# EAGLE design unoshield-v4 (EAGLE 8.7.1)
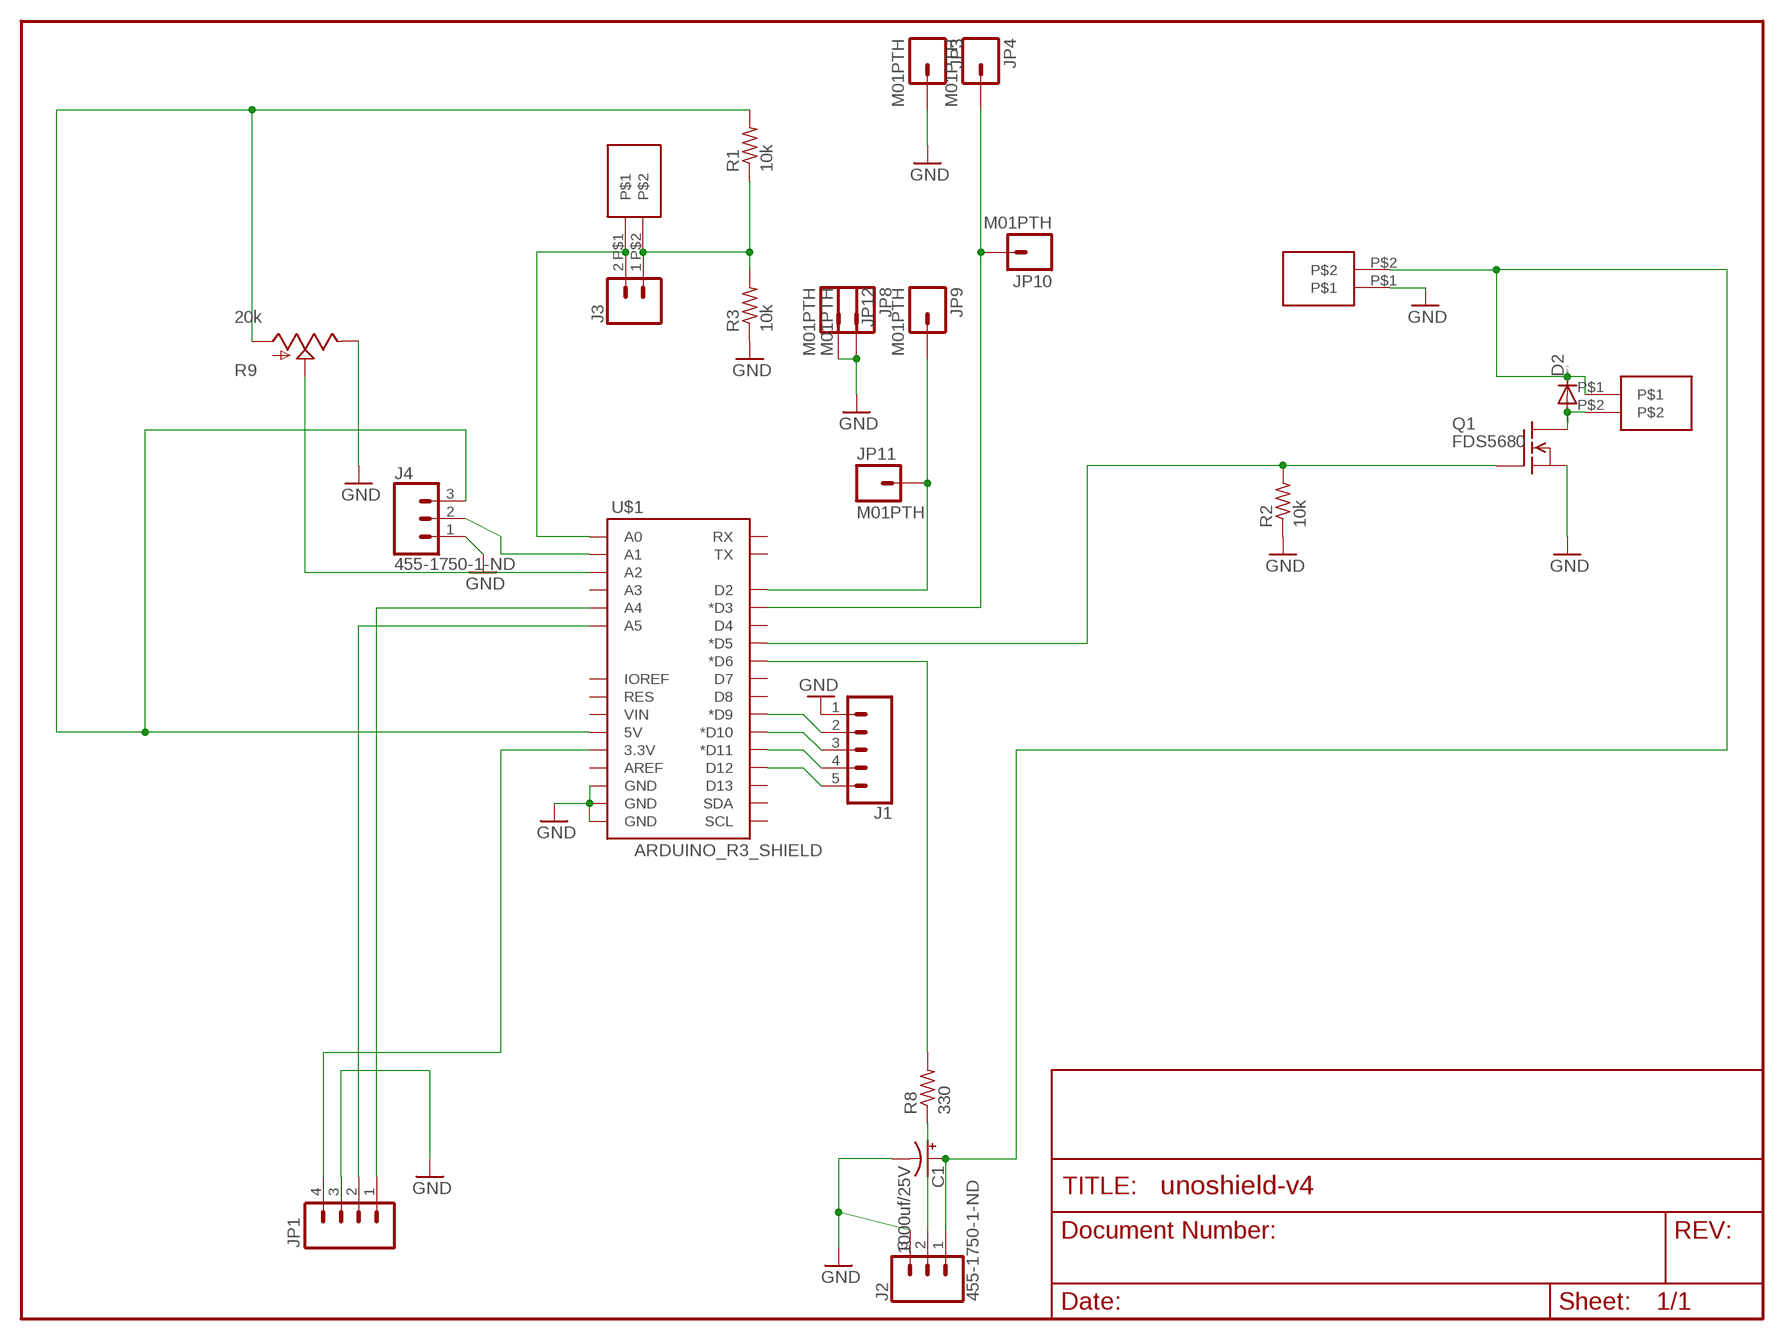
[diagram p0: schematic, sheet 1]

## Parts
C1  1000uf/25V  1000UF-25V(PTH)KIT  [CPOL-RADIAL-1000UF-25V-KIT]
D2  DIODE-DO-214AC  [DO-214AC]
J1  CONN_05  [1X05]
J2  455-1750-1-ND  CONN_03  [1X03]
J3  CONN_02  [1X02]
J4  455-1750-1-ND  CONN_03  [1X03]
JP1  M04PTH  [1X04]
JP3  M01PTH  [1X01]
JP4  M01PTH  [1X01]
JP8  M01PTH  [1X01]
JP9  M01PTH  [1X01]
JP10  M01PTH  [1X01]
JP11  M01PTH  [1X01]
JP12  M01PTH  [1X01]
Q1  FDS5680  [SO-8]
R1  10k  R-US_R0603  [R0603]
R2  10k  R-US_R0603  [R0603]
R3  10k  R-US_R0603  [R0603]
R8  330  R-US_R0603  [R0603]
R9  20k  POTALPS-KIT  [ALPS_POT_KIT]
U$1  ARDUINO_R3_SHIELD  [UNO_R3_SHIELD]
U$6  SPRING-TERMINAL  [SPRING-TERMINAL]
X1  SPRING-TERMINAL  [SPRING-TERMINAL]
X2  SPRING-TERMINAL  [SPRING-TERMINAL]

## Nets
5V: J4.3 R1.2 R9.P$3(A) U$1.5V
BUTTON: JP4.1 JP10.1 U$1.D3(*D3)
CL: JP1.2 U$1.A5
DA: JP1.1 U$1.A4
GND: C1.- J1.1 J2.3 J4.1 JP1.3 JP3.1 JP8.1 JP12.1 Q1.1(S) Q1.2(S) Q1.3(S) R2.1 R3.1 R9.P$1(E) U$1.GND@0(GND) U$1.GND@1(GND) U$1.GND@2(GND) X1.P$1
N$1: Q1.4(G) R2.2 U$1.D5(*D5)
N$4: R8.2 U$1.D6(*D6)
N$5: J3.1 R1.1 R3.2 X2.P$2
N$6: J4.2 U$1.A1
N$7: J1.5 U$1.D12
N$8: D2.A Q1.5(D) Q1.6(D) Q1.7(D) Q1.8(D) U$6.P$2
N$9: J1.4 U$1.D11(*D11)
N$10: J1.3 U$1.D10(*D10)
N$11: J1.2 U$1.D9(*D9)
N$12: JP9.1 JP11.1 U$1.D2
N$23: J3.2 U$1.A0 X2.P$1
N$25: J2.2 R8.1
N$28: R9.P$2(S) U$1.A2
VCC: JP1.4 U$1.3.3V
VIN: C1.+ D2.C J2.1 U$6.P$1 X1.P$2
Unconnected: U$1.A3 U$1.AREF U$1.D4 U$1.D7 U$1.D8 U$1.D13 U$1.IOREF U$1.RES U$1.RX U$1.SCL U$1.SDA U$1.TX U$1.VIN

## Library data of the parts
C1 = SparkFun-Capacitors:1000UF-25V(PTH): CAP-08070; PROD_ID: CAP-09538
D2 = diode:DIODE-: DIODE
J1 = SparkFun-Connectors:CONN_05: Multi connection point. Often used as Generic Header-pin footprint for 0.1 inch spaced/style header connections On any of the 0.1 inch spaced packages, you can populate with these: Break Away Headers - Straight <https://www.sparkfun.com/products/116> (PRT-00116) Break Away Male Headers - Right Angle <https://www.sparkfun.com/products/553> (PRT-00553) Female Headers <https://www.sparkfun.com/products/115> (PRT-00115) Break Away Headers - Machine Pin <https://www.sparkfun.com/products/117> (PRT-00117) Break Away Female Headers - Swiss Machine Pin <https://www.sparkfun.com/products/743> (PRT-00743) For SCREWTERMINALS and SPRING TERMINALS visit here: Screw Terimnals on SparkFun.com <https://www.sparkfun.com/search/results?term=Screw+Terminals> (5mm/3.5mm/2.54mm spacing) This device is also useful as a general connection point to wire up your design to another part of your project. Our various solder wires solder well into these plated through hole pads. Hook-Up Wire - Assortment (Stranded, 22 AWG) <https://www.sparkfun.com/products/11375> (PRT-11375) Hook-Up Wire - Assortment (Solid Core, 22 AWG) <https://www.sparkfun.com/products/11367> (PRT-11367) View the entire wire category on our website here <https://www.sparkfun.com/categories/141> Special notes: Molex polarized connector foot print use with SKU : PRT-08231 with associated crimp pins and housings. 1MM SMD Version SKU: PRT-10208
J2 J4 = SparkFun-Connectors:CONN_03: Multi connection point. Often used as Generic Header-pin footprint for 0.1 inch spaced/style header connections On any of the 0.1 inch spaced packages, you can populate with these: Break Away Headers - Straight <https://www.sparkfun.com/products/116> (PRT-00116) Break Away Male Headers - Right Angle <https://www.sparkfun.com/products/553> (PRT-00553) Female Headers <https://www.sparkfun.com/products/115> (PRT-00115) Break Away Headers - Machine Pin <https://www.sparkfun.com/products/117> (PRT-00117) Break Away Female Headers - Swiss Machine Pin <https://www.sparkfun.com/products/743> (PRT-00743) Stackable Header - 3 Pin (Female, 0.1") <https://www.sparkfun.com/products/13875> (PRT-13875) For SCREWTERMINALS and SPRING TERMINALS visit here: Screw Terimnals on SparkFun.com <https://www.sparkfun.com/search/results?term=Screw+Terminals> (5mm/3.5mm/2.54mm spacing) This device is also useful as a general connection point to wire up your design to another part of your project. Our various solder wires solder well into these plated through hole pads. Hook-Up Wire - Assortment (Stranded, 22 AWG) <https://www.sparkfun.com/products/11375> (PRT-11375) Hook-Up Wire - Assortment (Solid Core, 22 AWG) <https://www.sparkfun.com/products/11367> (PRT-11367) View the entire wire category on our website here <https://www.sparkfun.com/categories/141> Special notes: Molex polarized connector foot print use with SKU : PRT-08232 with associated crimp pins and housings.; PROD_ID: XXX-00000
J3 = SparkFun-Connectors:CONN_02: Multi connection point. Often used as Generic Header-pin footprint for 0.1 inch spaced/style header connections On any of the 0.1 inch spaced packages, you can populate with these: Break Away Headers - Straight <https://www.sparkfun.com/products/116> (PRT-00116) Break Away Male Headers - Right Angle <https://www.sparkfun.com/products/553> (PRT-00553) Female Headers <https://www.sparkfun.com/products/115> (PRT-00115) Break Away Headers - Machine Pin <https://www.sparkfun.com/products/117> (PRT-00117) Break Away Female Headers - Swiss Machine Pin <https://www.sparkfun.com/products/743> (PRT-00743) For SCREWTERMINALS and SPRING TERMINALS visit here: Screw Terimnals on SparkFun.com <https://www.sparkfun.com/search/results?term=Screw+Terminals> (5mm/3.5mm/2.54mm spacing) This device is also useful as a general connection point to wire up your design to another part of your project. Our various solder wires solder well into these plated through hole pads. Hook-Up Wire - Assortment (Stranded, 22 AWG) <https://www.sparkfun.com/products/11375> (PRT-11375) Hook-Up Wire - Assortment (Solid Core, 22 AWG) <https://www.sparkfun.com/products/11367> (PRT-11367) View the entire wire category on our website here <https://www.sparkfun.com/categories/141> Special notes: Molex polarized connector foot print use with: PRT-08233 with associated crimp pins and housings. 2.54_SCREWTERM for use with PRT-10571. 3.5mm Screw Terminal footprints for PRT-08084 5mm Screw Terminal footprints for use with PRT-08432
JP1 = SparkFun-Connectors:M04: Header 4 Standard 4-pin 0.1" header. Use with straight break away headers (SKU : PRT-00116), right angle break away headers (PRT-00553), swiss pins (PRT-00743), machine pins (PRT-00117), and female headers (PRT-00115). Molex polarized connector foot print use with SKU : PRT-08231 with associated crimp pins and housings. 1MM SMD Version SKU: PRT-10208
JP3 JP4 JP8-JP12 = SparkFun-Connectors:M01: Header 1 Standard 1-pin 0.1" header. Use with straight break away headers (SKU : PRT-00116), right angle break away headers (PRT-00553), swiss pins (PRT-00743), machine pins (PRT-00117), and female headers (PRT-00115).
Q1 = transistor-fet:FDS5680: 60V N-Channel PowerTrench TM MOSFET FAIRCHILD FDS5680.pdf
R1-R3 R8 = resistor:R-US_: RESISTOR, American symbol
R9 = SparkFun-Electromechanical:POT
U$1 = SparkFun-Boards:ARDUINO_R3_SHIELD: Shield form compatible with the Arduino Uno R3.
U$6 X1 X2 = spietz-library:SPRING-TERMINAL

## Net classes
0 default: width 0.203 mm
1 vcc: width 0.254 mm

## Board
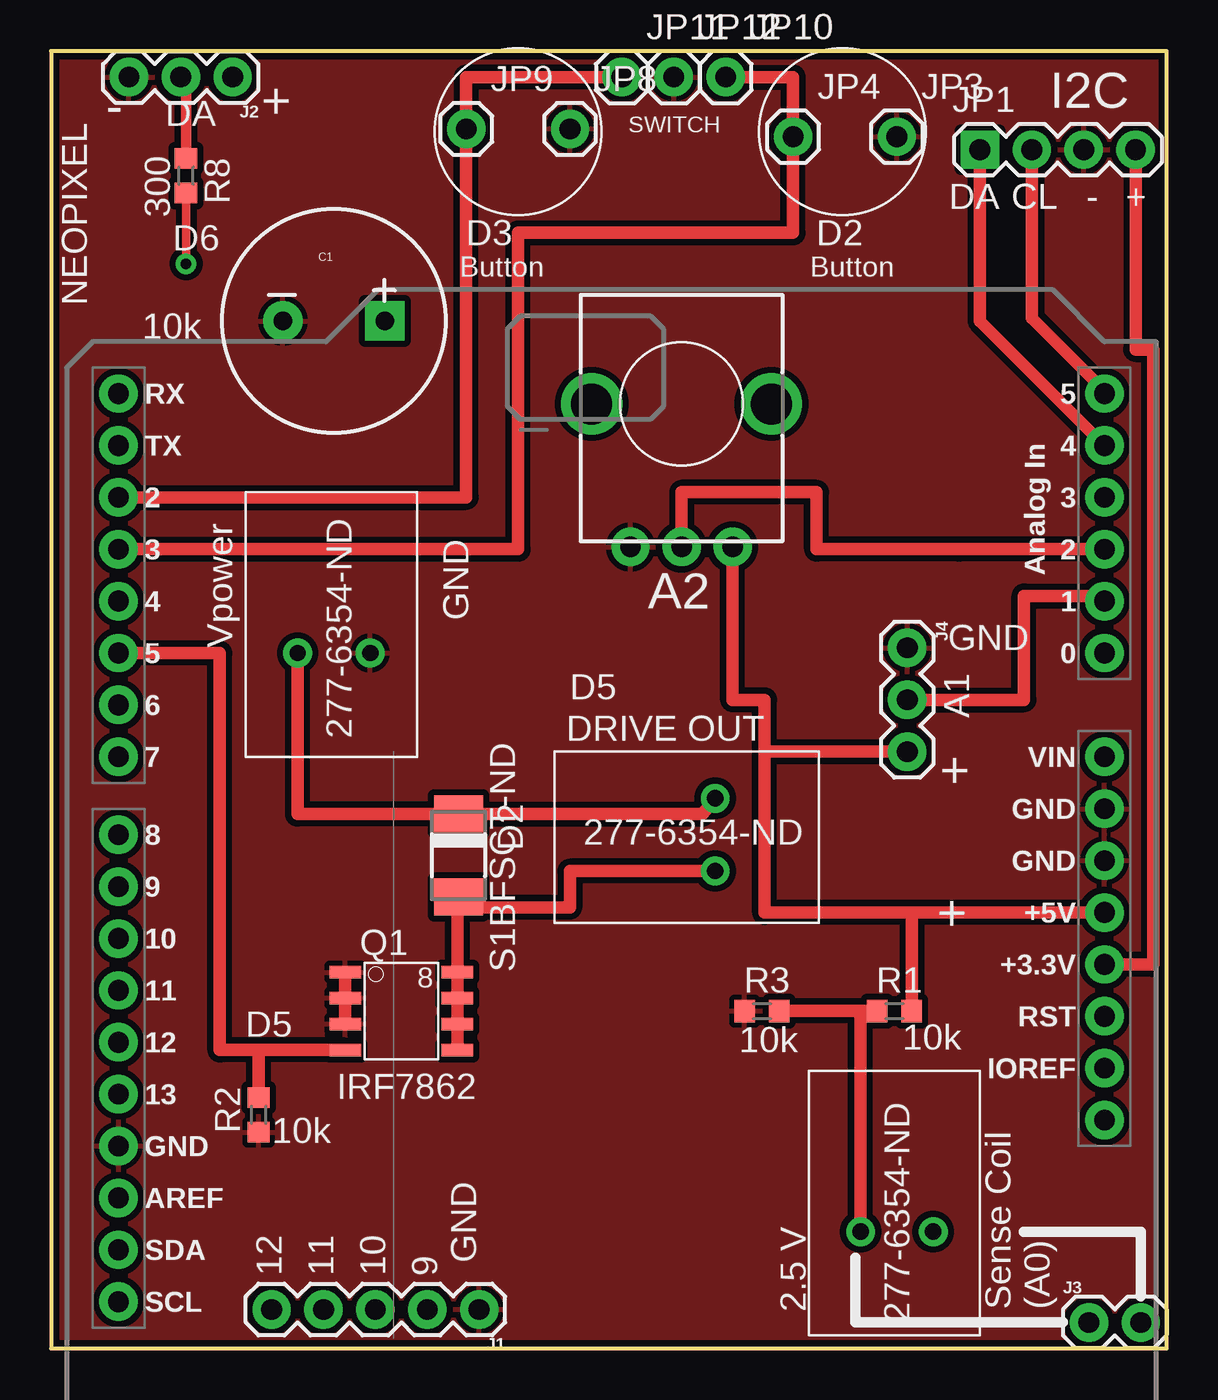
[diagram p1: board, top side]
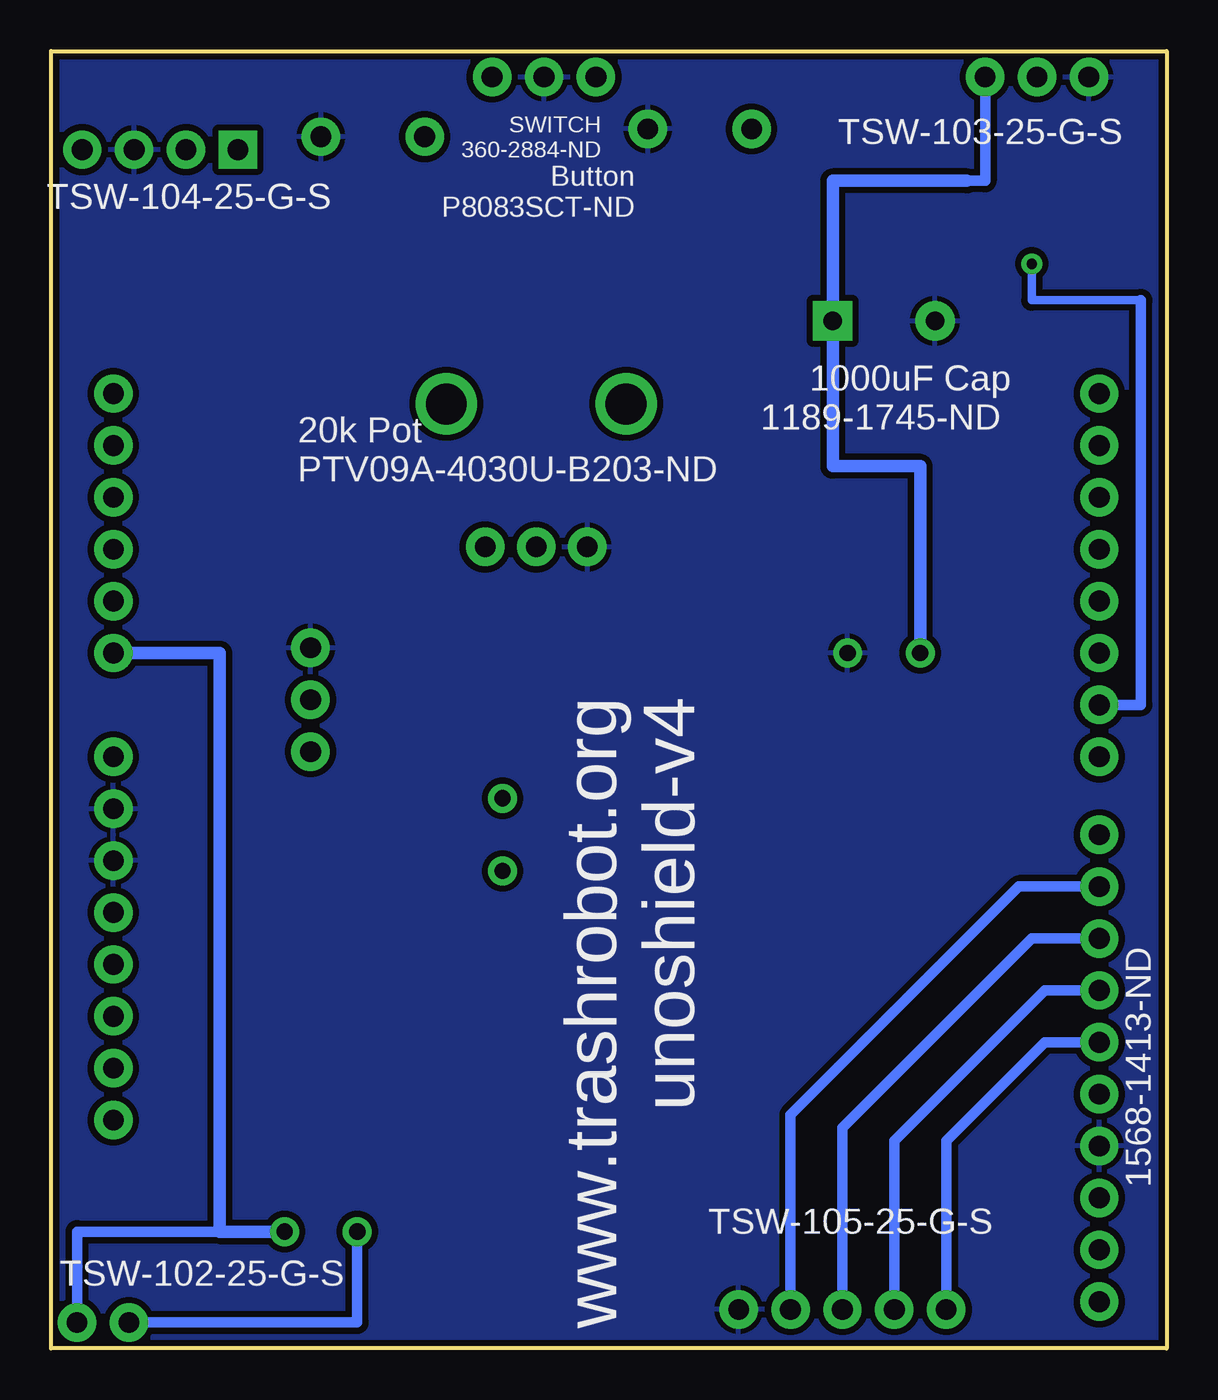
[diagram p2: board, bottom side, seen from below]

Size 54.61 x 63.5 mm. Coordinates in mm from the lower left corner, seen from the top.
Outline: 0,63.5 0,0 54.61,0 54.61,63.5 0,63.5
Copper layers (1*16): Top 0.035mm / dielectric 1.5mm / Bottom 0.035mm
Design rules "default": minimum track width 8mil, minimum drill 20mil, track to track 8mil, track to pad 8mil, pad to pad 8mil, via to via 8mil, smd to smd 8mil, copper to edge 10mil, drill to drill 8mil, minimum pad ring 12mil, minimum via ring 10mil, stop-mask expansion 4mil, vias tented up to drill 25mil, thermal gap 10mil

### Footprints (pad centres in the part's own frame; a part is rotated, then mirrored left to right if it is on the bottom)
CPOL-RADIAL-1000UF-25V-KIT = drill 0.9 pad 1.93 square: + 2.5,0 | drill 0.9 pad 1.93: - -2.5,0
DO-214AC = smd 1.8 x 2.4: A 2.025,0; C -2.025,0
1X05 = drill 1.016 pad 1.88: 1 0,0; 2 2.54,0; 3 5.08,0; 4 7.62,0; 5 10.16,0
1X03 = drill 1.016 pad 1.88: 1 0,0; 2 2.54,0; 3 5.08,0
1X02 = drill 1.016 pad 1.88: 1 0,0; 2 2.54,0
1X04 = drill 1.016 pad 1.88 square: 1 0,0 | drill 1.016 pad 1.88: 2 2.54,0; 3 5.08,0; 4 7.62,0
1X01 = drill 1.016 pad 1.88: 1 0,0
SO-8 = smd 1.524 x 0.61: 1 -2.743,1.905; 2 -2.743,0.635; 3 -2.743,-0.635; 4 -2.743,-1.905; 5 2.743,-1.905; 6 2.743,-0.635; 7 2.743,0.635; 8 2.743,1.905
R0603 = smd 1 x 1.1: 1 -0.85,0; 2 0.85,0
ALPS_POT_KIT = drill 1 pad 1.88: P$1 7,-2.5; P$2 7,0; P$3 7,2.5 | drill 2: P$4 0,-4.4; P$5 0,4.4
UNO_R3_SHIELD = drill 1.016 pad 1.88: 3.3V 50.8,26.67; 5V 50.8,29.21; A0 50.8,41.91; A1 50.8,44.45; A2 50.8,46.99; A3 50.8,49.53; A4 50.8,52.07; A5 50.8,54.61; AREF 2.54,15.24; D2 2.54,49.53; D3 2.54,46.99; D4 2.54,44.45; D5 2.54,41.91; D6 2.54,39.37; D7 2.54,36.83; D8 2.54,33.02; D9 2.54,30.48; D10 2.54,27.94; D11 2.54,25.4; D12 2.54,22.86; D13 2.54,20.32; GND@0 50.8,31.75; GND@1 50.8,34.29; GND@2 2.54,17.78; IOREF 50.8,21.59; NC 50.8,19.05; RES 50.8,24.13; RX 2.54,54.61; SCL 2.54,10.16; SDA 2.54,12.7; TX 2.54,52.07; VIN 50.8,36.83
SPRING-TERMINAL = drill 0.8: P$1 5.08,1.778; P$2 5.08,5.334

### Placement (x,y rotation side)
C1  13.84,50.29 0 top
D2  19.94,24.13 270 top
J1  20.95,1.91 180 top
J2  8.89,62.23 180 top
J3  50.8,1.27 0 top
J4  41.91,34.29 270 top
JP1  45.47,58.67 0 top
JP3  41.4,59.31 0 top
JP4  36.32,59.31 0 top
JP8  25.4,59.69 0 top
JP9  20.32,59.69 0 top
JP10  33.02,62.23 0 top
JP11  27.94,62.23 0 top
JP12  30.48,62.23 0 top
Q1  17.14,16.51 0 top
R1  41.28,16.51 0 top
R2  10.16,11.43 90 top
R3  34.8,16.51 0 top
R8  6.6,57.4 270 top
R9  30.86,46.23 270 top
U$1  0.76,-7.87 0 top
U$6  37.59,28.7 180 top
X1  17.4,28.96 90 top
X2  44.96,0.64 90 top

### Tracks (layer width: path | path; a pad name or v marks a point on that pad's centre or on a via)
5V
  Top 0.61: U$1.5V 42.12,21.34 | 42.12,21.34 R1.2 | R9.P$3 33.36,31.75 34.93,31.75 34.93,29.21 | 42.12,21.34 34.93,21.34 34.93,29.21 | 34.93,29.21 J4.3
BUTTON
  Top 0.61: U$1.D3 22.86,39.12 22.86,54.61 36.32,54.61 JP4.1 36.32,62.23 JP10.1
CL
  Top 0.61: JP1.2 48.01,50.42 51.69,46.74 | 52.07,46.35 51.69,46.74 | 51.69,46.74 U$1.A5
  Bottom 0.61: 51.31,46.99 U$1.A5
DA
  Top 0.61: JP1.1 45.47,50.29 U$1.A4
GND
  Top 0.61: Q1.3 Q1.2 Q1.1
  pour Top (isolate 0.305): 0,63.5 55.88,63.5 55.88,0 0,0
  pour Bottom (isolate 0.305): 0,63.5 56.52,63.5 56.52,0 0,0
N$1
  Top 0.61: Q1.4 10.16,14.61 | 10.16,14.61 8.26,14.61 8.26,34.04 U$1.D5 | R2.2 10.16,14.61
N$4  (via drill 0.5)
  Top 0.406: R8.2 v6.6,53.09
  Bottom 0.406: v6.6,53.09 6.6,51.31 1.27,51.31
  Bottom 0.508: U$1.D6 1.27,31.5 1.27,51.31
N$5
  Top 0.61: X2.P$2 39.62,16.51 | 39.62,16.51 R3.2 | R1.1 39.62,16.51
  Bottom 0.508: J3.1 39.62,1.27 X2.P$2
N$6
  Top 0.61: U$1.A1 51.56,36.83 47.62,36.83 47.62,31.75 J4.2
N$7
  Bottom 0.508: U$1.D12 5.97,14.99 10.79,10.16 10.79,2.54 11.43,1.91 J1.5
N$8
  Top 0.61: Q1.5 Q1.6 Q1.7 Q1.8 19.89,22.11 D2.A 19.68,22.11 20.95,21.59 25.4,21.59 25.4,23.37 U$6.P$2
N$9
  Bottom 0.508: U$1.D11 5.97,17.53 13.33,10.16 J1.4
N$10
  Bottom 0.508: U$1.D10 6.6,20.07 15.88,10.79 J1.3
N$11
  Bottom 0.508: U$1.D9 7.24,22.61 18.41,11.43 J1.2
N$12
  Top 0.61: U$1.D2 20.32,41.66 JP9.1 20.32,62.23 JP11.1
N$23
  Bottom 0.508: J3.2 53.34,5.71 46.36,5.71
  Bottom 0.61: U$1.A0 46.36,34.04 46.36,5.71 X2.P$1
N$25
  Top 0.508: R8.1 6.6,62.23 J2.2
N$28
  Top 0.152: 44.2,39.37 44.45,39.12
  Top 0.61: U$1.A2 44.45,39.12 37.47,39.12 37.47,41.91 30.86,41.91 R9.P$2
VCC
  Top 0.61: JP1.4 53.09,48.9 53.95,48.9 53.95,18.8 U$1.3.3V
VIN
  Top 0.61: U$6.P$1 31.88,26.16 D2.C 12.06,26.16 X1.P$2
  Bottom 0.508: J2.1 8.89,57.15 9.78,57.15
  Bottom 0.61: X1.P$2 12.06,43.18 16.34,43.18 C1.+ 16.34,57.15 9.78,57.15

### Text on the board
tPlace: I2C | - | DA | + | SWITCH | DA | CL | - | + | 300 | D6 | D3 | D2 | Button | Button | NEOPIXEL | 10k | 277-6354-ND | Vpower | GND | A2 | GND | D5 | DRIVE OUT | A1 | + | 277-6354-ND | + | S1BFSCT-ND | D5 | 10k | 10k | IRF7862 | 277-6354-ND | 10k | 2.5 V | 12 | 11 | 10 | 9 | GND | Sense Coil / (A0)
bPlace: TSW-103-25-G-S | SWITCH / 360-2884-ND | Button / P8083SCT-ND | TSW-104-25-G-S | 1000uF Cap / 1189-1745-ND | 20k Pot / PTV09A-4030U-B203-ND | www.trashrobot.org / unoshield-v4 | 1568-1413-ND | TSW-105-25-G-S | TSW-102-25-G-S
tValues: Tent Vias! | Arduino Wee v1.3